# EAGLE design NEOBoard_V4 (EAGLE 7.7.0)
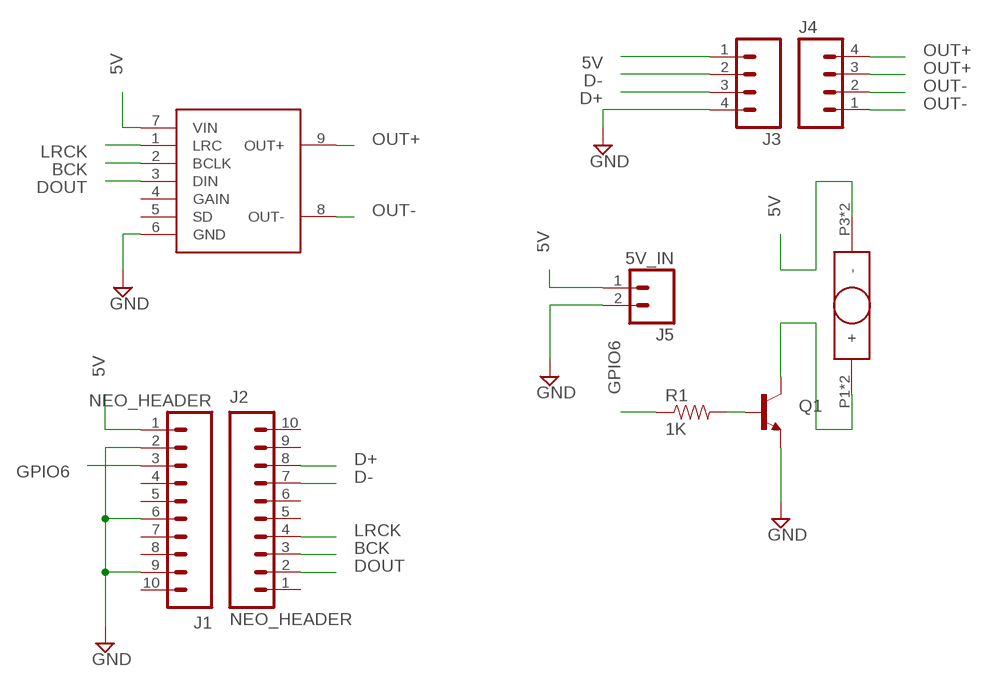
[diagram p0: schematic, sheet 1]

## Parts
J1  NEO_HEADER  M10NO_SILK_PTH_FEMALE  [1X10_NO_SILK]
J2  NEO_HEADER  M10NO_SILK_PTH_FEMALE  [1X10_NO_SILK]
J3  M04NO_SILK_ALL_ROUND  [1X04_NO_SILK_ALL_ROUND]
J4  M04NO_SILK_ALL_ROUND  [1X04_NO_SILK_ALL_ROUND]
J5  5V_IN  M021X02_NO_SILK  [1X02_NO_SILK]
Q1  TRANSISTOR_NPNTO92  [TO-92]
R1  1K  1KOHM-1/4W-1%(PTH)  [AXIAL-0.3]
U$1  I2S_BREAKOUT  [I2S_BREAKOUT]
U$2  FUSER  [FUSE]

## Nets
5V: J1.1 J3.1 J5.1 U$1.7(VIN) U$2.P3(-) U$2.P4(-)
BCK: J2.3 U$1.2(BCLK)
D+: J2.8 J3.3
D-: J2.7 J3.2
DOUT: J2.2 U$1.3(DIN)
GND: J1.2 J1.6 J1.9 J3.4 J5.2 Q1.1(E) U$1.6(GND)
GPIO6: J1.3 R1.P$1
LRCK: J2.4 U$1.1(LRC)
N$1: Q1.2(B) R1.P$2
N$2: Q1.3(C) U$2.P1(+) U$2.P2(+)
OUT+: J4.3 J4.4 U$1.9(OUT+)
OUT-: J4.1 J4.2 U$1.8(OUT-)
Unconnected: J1.4 J1.5 J1.7 J1.8 J1.10 J2.1 J2.5 J2.6 J2.9 J2.10 U$1.4(GAIN) U$1.5(SD)

## Library data of the parts
J1 J2 = SparkFun-Connectors:M10: Header 10 Standard 10-pin 0.1" header. Use with straight break away headers (SKU : PRT-00116), right angle break away headers (PRT-00553), swiss pins (PRT-00743), machine pins (PRT-00117), and female headers (PRT-00115).; PROD_ID: CONN-11563
J3 J4 = SparkFun-Connectors:M04: Header 4 Standard 4-pin 0.1" header. Use with straight break away headers (SKU : PRT-00116), right angle break away headers (PRT-00553), swiss pins (PRT-00743), machine pins (PRT-00117), and female headers (PRT-00115). Molex polarized connector foot print use with SKU : PRT-08231 with associated crimp pins and housings. 1MM SMD Version SKU: PRT-10208; PROD_ID: CONN-09696
J5 = SparkFun-Connectors:M02: Standard 2-pin 0.1" header. Use with - straight break away headers ( PRT-00116) - right angle break away headers (PRT-00553) - swiss pins (PRT-00743) - machine pins (PRT-00117) - female headers (PRT-00115) Molex polarized connector foot print use with: PRT-08233 with associated crimp pins and housings. 2.54_SCREWTERM for use with PRT-10571. 3.5mm Screw Terminal footprints for PRT-08084 5mm Screw Terminal footprints for use with PRT-08432
Q1 = SparkFun-DiscreteSemi:TRANSISTOR_NPN: Generic NPN BJT MMBT2222A - TRANS-08049 (SOT-23, 1A 40V) MPSA42 - TRANS-09116 (SOT-23, 500mA 300V) MMBT5088LT1G - TRANS-11160 (SOT-23, 50 mA 30V) BC547 - COM-08928 <http://www.sparkfun.com/products/8928> (TO-92 45V 100mA) (1.Collector 2.Base 3.Emitter) 2N3904 - COM-00521 <http://www.sparkfun.com/products/521> (TO-92 40V 200mA) (1.Emitter 2.Base 3.Collector) P2N2222A - COM-12852 <http://www.sparkfun.com/products/12852> (TO-92 40V 600mA) (1.Collector 2.Base 3.Emitter)
R1 = SparkFun-Resistors:1KOHM-1/4W-1%(PTH): RES-12182; PROD_ID: RES-12182
U$1 = whisper_PCB:I2S_BREAKOUT
U$2 = whisper_PCB:FUSER

## Board
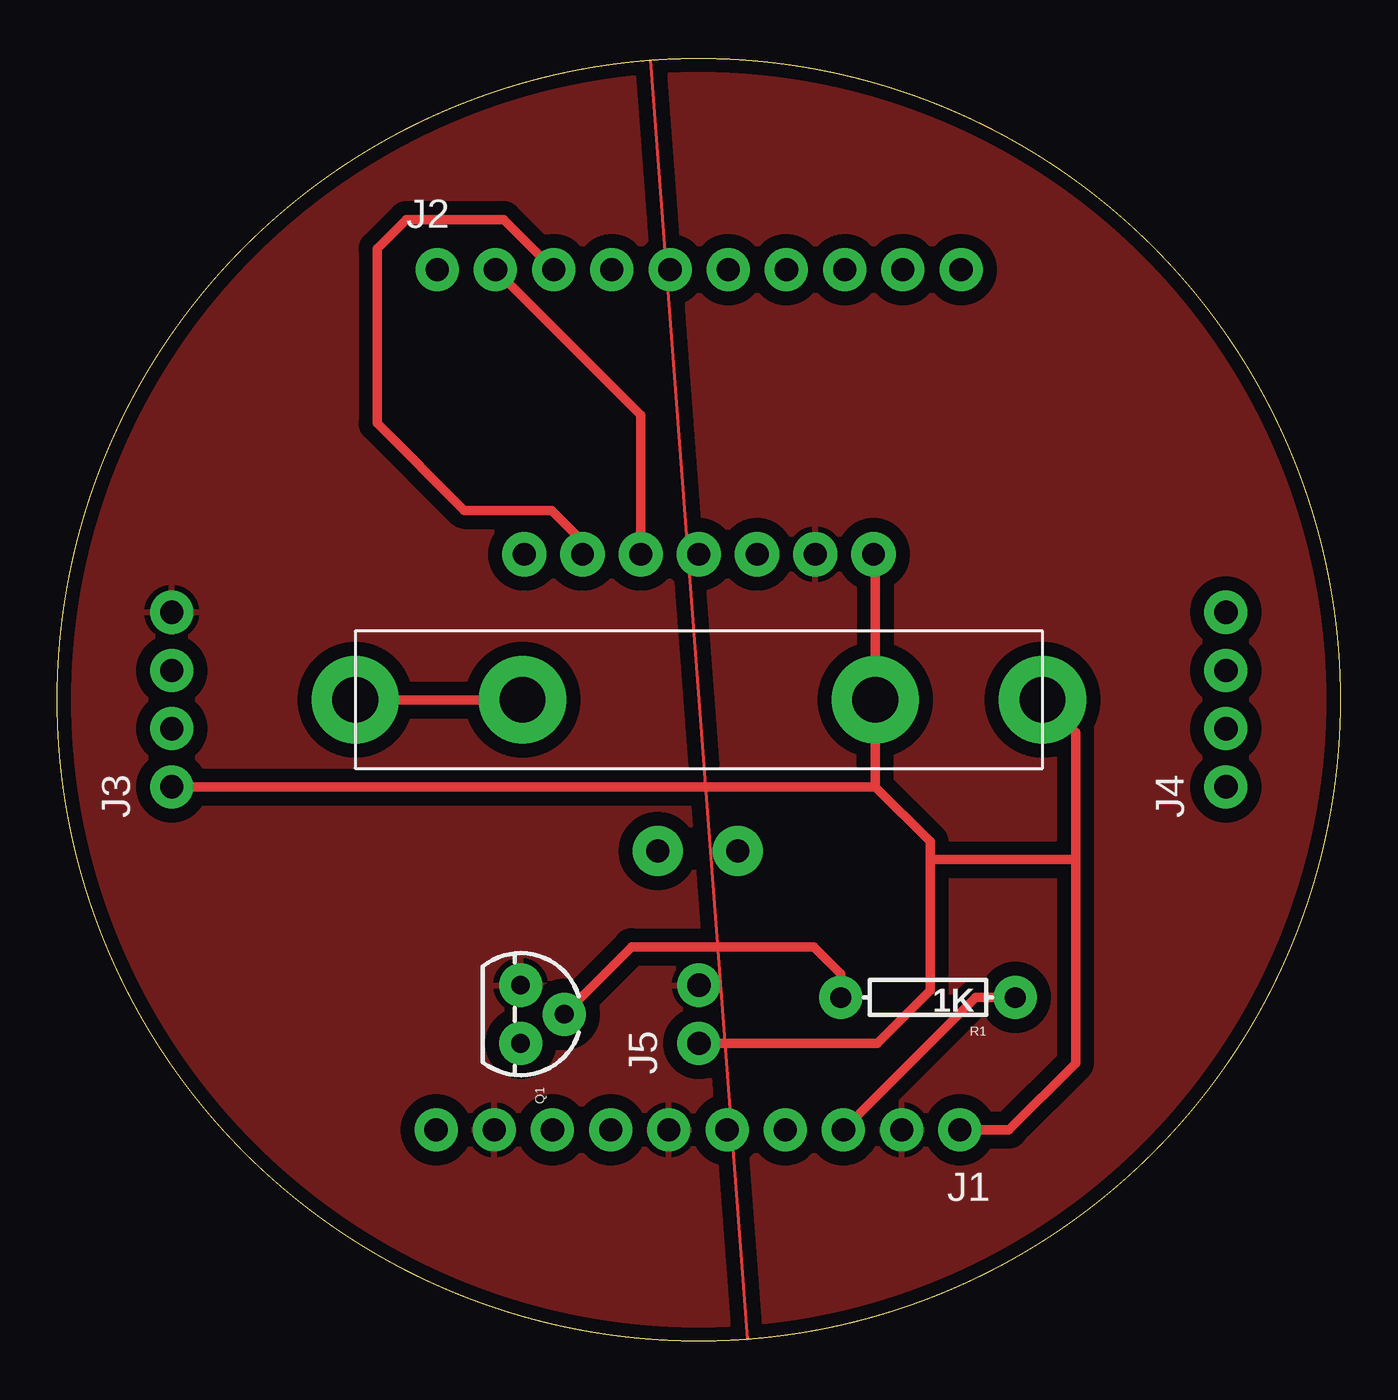
[diagram p1: board, top side]
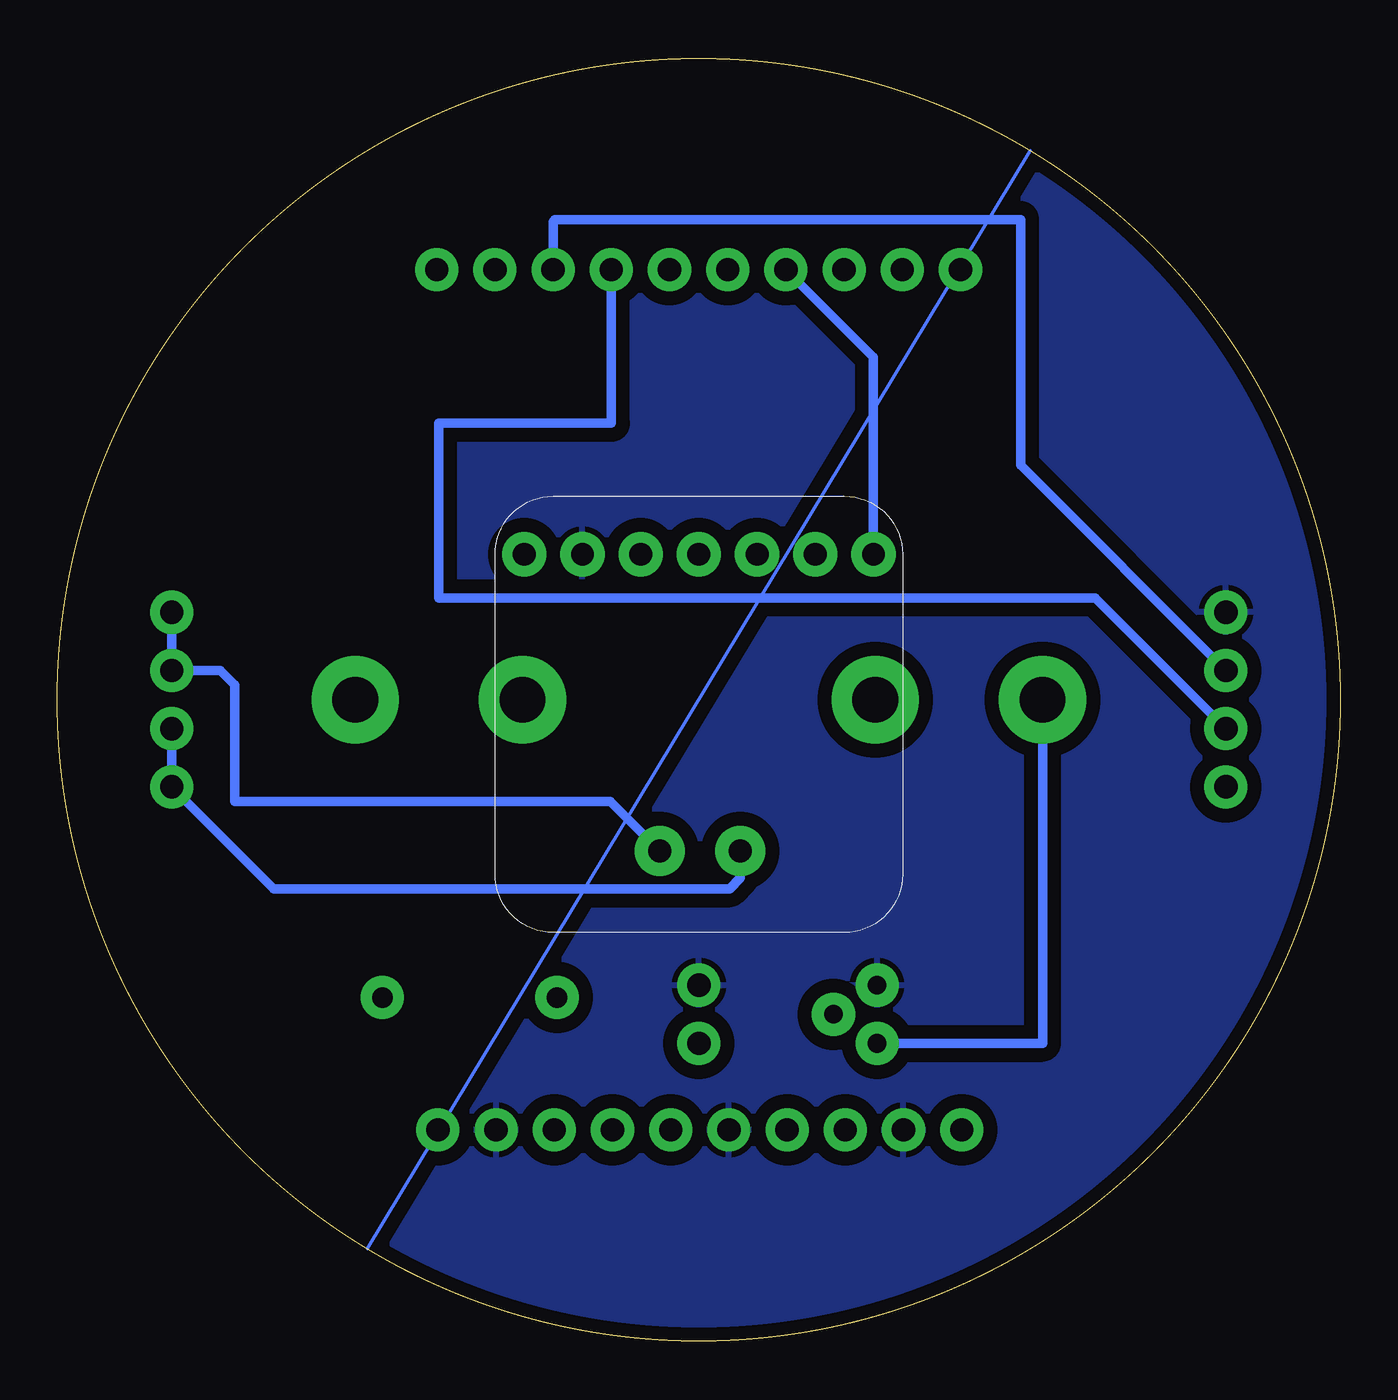
[diagram p2: board, bottom side, seen from below]

Size 56 x 56 mm. Coordinates in mm from the lower left corner, seen from the top.
Outline: circle at 28,28 radius 28
Copper layers (1*16): Top 0.035mm / dielectric 1.5mm / Bottom 0.035mm
Design rules "SparkFun": minimum track width 8mil, minimum drill 20mil, track to track 8mil, track to pad 8mil, pad to pad 8mil, via to via 8mil, smd to smd 8mil, copper to edge 10mil, drill to drill 8mil, minimum pad ring 12mil, minimum via ring 10mil, stop-mask expansion 4mil, vias tented up to drill 25mil, thermal gap 10mil

### Footprints (pad centres in the part's own frame; a part is rotated, then mirrored left to right if it is on the bottom)
1X10_NO_SILK = drill 1.016 pad 1.88: 1 0,0; 2 2.54,0; 3 5.08,0; 4 7.62,0; 5 10.16,0; 6 12.7,0; 7 15.24,0; 8 17.78,0; 9 20.32,0; 10 22.86,0
1X04_NO_SILK_ALL_ROUND = drill 1.016 pad 1.88: 1 0,0; 2 2.54,0; 3 5.08,0; 4 7.62,0
1X02_NO_SILK = drill 1.016 pad 1.88: 1 0,0; 2 2.54,0
TO-92 = drill 0.813 pad 1.88: 1 -1.27,0; 2 0,1.905; 3 1.27,0
AXIAL-0.3 = drill 0.9 pad 1.88: P$1 -3.81,0; P$2 3.81,0
I2S_BREAKOUT = drill 1 pad 1.93: 1 -7.62,-6.35; 2 -5.08,-6.35; 3 -2.54,-6.35; 4 0,-6.35; 5 2.54,-6.35; 6 5.08,-6.35; 7 7.62,-6.35 | drill 1 pad 2.184: 8 -1.8,6.604; 9 1.7,6.604
FUSE = drill 2 pad 3.81: P1 -15,0; P2 -7.7,0; P3 7.7,0; P4 15,0

### Placement (x,y rotation side)
J1  39.39,9.22 180 top
J2  16.58,46.77 0 top
J3  5,24.2 90 top
J4  51,24.2 90 top
J5  28,13 90 top
Q1  20.22,14.27 270 top
R1  38,15 180 top
U$1  28,28 180 bottom
U$2  28,28 0 top

### Tracks (layer width: path | path; a pad name or v marks a point on that pad's centre or on a via)
5V
  Top 0.406: J3.1 35.7,24.2 | 35.7,24.2 U$2.P3 35.7,34.35 U$1.7 | J5.1 35.78,13 38.09,15.3 38.09,21.02 | 38.09,21.02 38.09,21.81 35.7,24.2 | J1.1 41.53,9.22 44.44,12.13 44.44,21.02 | 44.44,21.02 44.44,26.56 U$2.P4 | 38.09,21.02 44.44,21.02
BCK
  Top 0.406: J2.3 19.48,48.96 15.23,48.96 13.96,47.69 13.96,40.07 17.77,36.26 21.58,36.26 22.92,34.92 U$1.2
D+
  Bottom 0.406: J3.3 13.96,38.24 13.96,48.96 34.28,48.96 34.36,48.88 J2.8
D-
  Bottom 0.406: J3.2 10.71,32.45 39.36,32.45 39.36,40.07 31.82,40.07 J2.7
DOUT
  Top 0.406: J2.2 25.46,40.44 U$1.3
GND
  pour Bottom (isolate 0.61): -7,58 -7,-7 63,-7 63,63 -7,63
  pour Top (isolate 0.61): -7,63 -7,-7 63,-7 63,63
GPIO6
  Top 0.406: J1.3 40.09,15 R1.P$1
LRCK
  Bottom 0.406: J2.4 20.38,42.95 U$1.1
N$1
  Top 0.406: Q1.2 25.06,17.21 33.01,17.21 34.19,16.03 R1.P$2
N$2
  Top 0.406: U$2.P1 U$2.P2
  Bottom 0.406: Q1.3 13,13 U$2.P1
OUT+
  Bottom 0.406: U$1.9 31.86,23.56 48.25,23.56 48.25,28.64 48.89,29.28 J4.3 J4.4
OUT-
  Bottom 0.406: U$1.8 26.2,20.21 26.66,19.75 46.55,19.75 J4.1 J4.2
(copper drawn outside any net)
  shapes: Bottom area x1, Top area x1